# EAGLE design barrieren-a-3 (EAGLE 9.6.2)
AUTHOR: Balazs Racz; DRAWING_TITLE: MEB Schalterwerk Projekt; LICENSE: Licensed by the Solderpad Hardware License V2.0; REVIEWER: n/a; REVISION: A5; YEAR: 2023
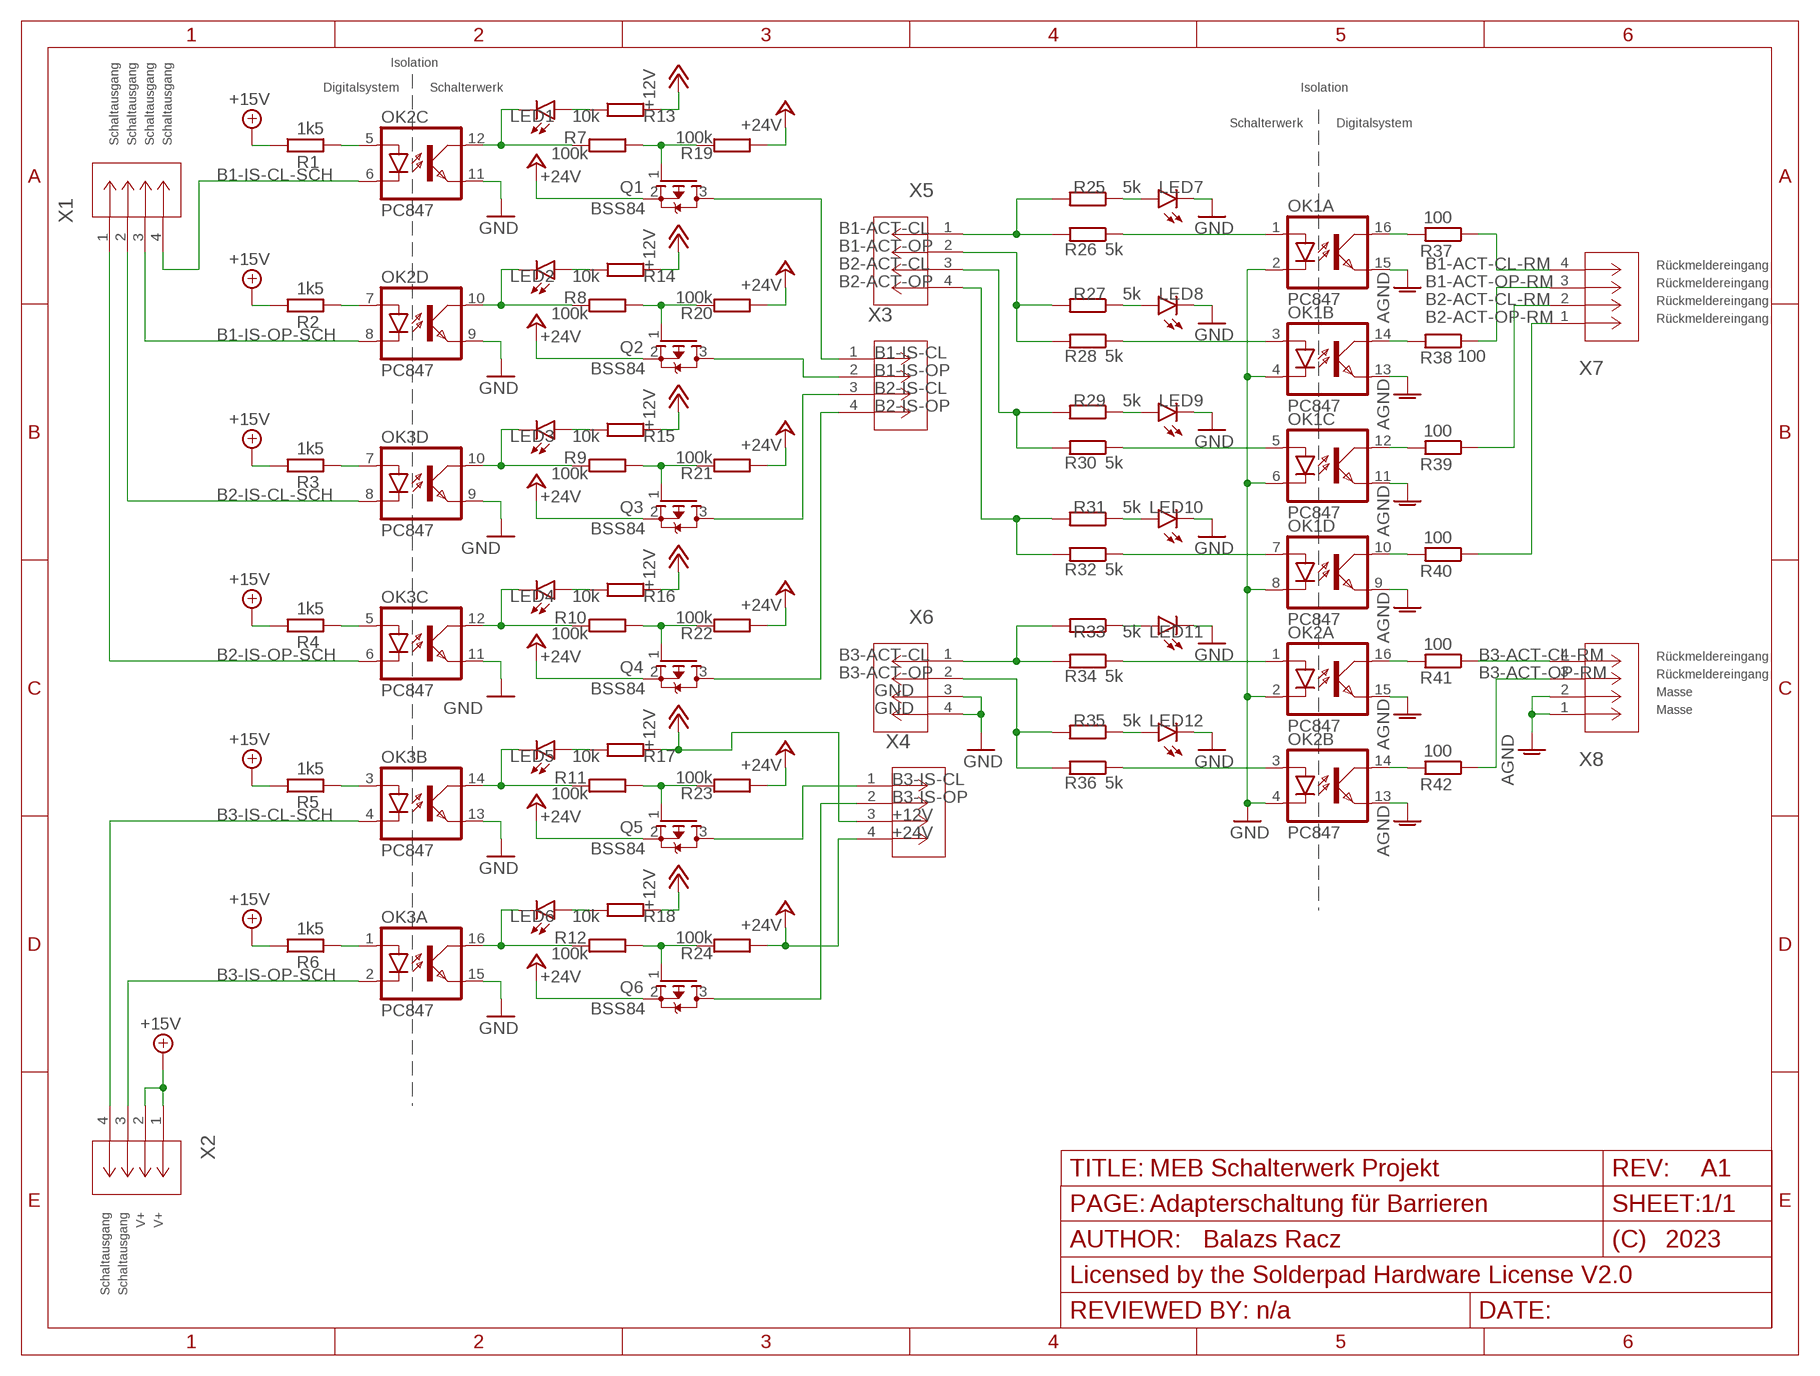
[diagram p0: schematic, sheet 1]
FRAME1 (FRAME_A_L): PAGE: Input ports
FRAME2 (FRAME_A_L): PAGE: Adapterschaltung für Barrieren; REVISION: A1

## Parts
LED1  LEDCHIPLED_0603  [CHIPLED_0603]
LED2  LEDCHIPLED_0603  [CHIPLED_0603]
LED3  LEDCHIPLED_0603  [CHIPLED_0603]
LED4  LEDCHIPLED_0603  [CHIPLED_0603]
LED5  LEDCHIPLED_0603  [CHIPLED_0603]
LED6  LEDCHIPLED_0603  [CHIPLED_0603]
LED7  LEDCHIPLED_0603  [CHIPLED_0603]
LED8  LEDCHIPLED_0603  [CHIPLED_0603]
LED9  LEDCHIPLED_0603  [CHIPLED_0603]
LED10  LEDCHIPLED_0603  [CHIPLED_0603]
LED11  LEDCHIPLED_0603  [CHIPLED_0603]
LED12  LEDCHIPLED_0603  [CHIPLED_0603]
OK1  PC847  [DIL16]
OK2  PC847  [DIL16]
OK3  PC847  [DIL16]
Q1  BSS84  [SOT23-PCH]
Q2  BSS84  [SOT23-PCH]
Q3  BSS84  [SOT23-PCH]
Q4  BSS84  [SOT23-PCH]
Q5  BSS84  [SOT23-PCH]
Q6  BSS84  [SOT23-PCH]
R1  1k5  R-EU_R0805  [R0805]
R2  1k5  R-EU_R0805  [R0805]
R3  1k5  R-EU_R0805  [R0805]
R4  1k5  R-EU_R0805  [R0805]
R5  1k5  R-EU_R0805  [R0805]
R6  1k5  R-EU_R0805  [R0805]
R7  100k  R-EU_R0805  [R0805]
R8  100k  R-EU_R0805  [R0805]
R9  100k  R-EU_R0805  [R0805]
R10  100k  R-EU_R0805  [R0805]
R11  100k  R-EU_R0805  [R0805]
R12  100k  R-EU_R0805  [R0805]
R13  10k  R-EU_R0805  [R0805]
R14  10k  R-EU_R0805  [R0805]
R15  10k  R-EU_R0805  [R0805]
R16  10k  R-EU_R0805  [R0805]
R17  10k  R-EU_R0805  [R0805]
R18  10k  R-EU_R0805  [R0805]
R19  100k  R-EU_R0805  [R0805]
R20  100k  R-EU_R0805  [R0805]
R21  100k  R-EU_R0805  [R0805]
R22  100k  R-EU_R0805  [R0805]
R23  100k  R-EU_R0805  [R0805]
R24  100k  R-EU_R0805  [R0805]
R25  5k  R-EU_R0805  [R0805]
R26  5k  R-EU_R0805  [R0805]
R27  5k  R-EU_R0805  [R0805]
R28  5k  R-EU_R0805  [R0805]
R29  5k  R-EU_R0805  [R0805]
R30  5k  R-EU_R0805  [R0805]
R31  5k  R-EU_R0805  [R0805]
R32  5k  R-EU_R0805  [R0805]
R33  5k  R-EU_R0805  [R0805]
R34  5k  R-EU_R0805  [R0805]
R35  5k  R-EU_R0805  [R0805]
R36  5k  R-EU_R0805  [R0805]
R37  100  R-EU_R0805  [R0805]
R38  100  R-EU_R0805  [R0805]
R39  100  R-EU_R0805  [R0805]
R40  100  R-EU_R0805  [R0805]
R41  100  R-EU_R0805  [R0805]
R42  100  R-EU_R0805  [R0805]
X1  PHNX_4P_350CONN_1984989_PXC  [PHNX_4P_350]
X2  PHNX_4P_350CONN_1984989_PXC  [PHNX_4P_350]
X3  PHNX_4P_350CONN_1984989_PXC  [PHNX_4P_350]
X4  PHNX_4P_350CONN_1984989_PXC  [PHNX_4P_350]
X5  PHNX_4P_350CONN_1984989_PXC  [PHNX_4P_350]
X6  PHNX_4P_350CONN_1984989_PXC  [PHNX_4P_350]
X7  PHNX_4P_350CONN_1984989_PXC  [PHNX_4P_350]
X8  PHNX_4P_350CONN_1984989_PXC  [PHNX_4P_350]

## Nets
+12V: R13.2 R14.2 R15.2 R16.2 R17.2 R18.2 X4.3
+15V: R1.1 R2.1 R3.1 R4.1 R5.1 R6.1 X2.1 X2.2
+24V: Q1.2(S) Q2.2(S) Q3.2(S) Q4.2(S) Q5.2(S) Q6.2(S) R19.2 R20.2 R21.2 R22.2 R23.2 R24.2 X4.4
AGND: OK1.9(D:EMIT) OK1.11(C:EMIT) OK1.13(B:EMIT) OK1.15(A:EMIT) OK2.13(B:EMIT) OK2.15(A:EMIT) X8.1 X8.2
B1-ACT-CL: R25.2 R26.2 X5.1
B1-ACT-CL-RM: R37.1 X7.4
B1-ACT-OP: R27.2 R28.2 X5.2
B1-ACT-OP-RM: R38.1 X7.3
B1-IS-CL: Q1.3(D) X3.1
B1-IS-CL-SCH: OK2.6(C:C) X1.4
B1-IS-OP: Q2.3(D) X3.2
B1-IS-OP-SCH: OK2.8(D:C) X1.3
B2-ACT-CL: R29.2 R30.2 X5.3
B2-ACT-CL-RM: R39.1 X7.2
B2-ACT-OP: R31.2 R32.2 X5.4
B2-ACT-OP-RM: R40.1 X7.1
B2-IS-CL: Q3.3(D) X3.3
B2-IS-CL-SCH: OK3.8(D:C) X1.2
B2-IS-OP: Q4.3(D) X3.4
B2-IS-OP-SCH: OK3.6(C:C) X1.1
B3-ACT-CL: R33.2 R34.2 X6.1
B3-ACT-CL-RM: R41.1 X8.4
B3-ACT-OP: R35.2 R36.2 X6.2
B3-ACT-OP-RM: R42.1 X8.3
B3-IS-CL: Q5.3(D) X4.1
B3-IS-CL-SCH: OK3.4(B:C) X2.4
B3-IS-OP: Q6.3(D) X4.2
B3-IS-OP-SCH: OK3.2(A:C) X2.3
GND: LED7.C LED8.C LED9.C LED10.C LED11.C LED12.C OK1.2(A:C) OK1.4(B:C) OK1.6(C:C) OK1.8(D:C) OK2.2(A:C) OK2.4(B:C) OK2.9(D:EMIT) OK2.11(C:EMIT) OK3.9(D:EMIT) OK3.11(C:EMIT) OK3.13(B:EMIT) OK3.15(A:EMIT) X6.3 X6.4
N$1: Q1.1(G) R7.1 R19.1
N$2: OK2.1(A:A) R34.1
N$3: LED12.A R35.1
N$4: LED11.A R33.1
N$5: OK2.5(C:A) R1.2
N$6: OK1.12(C:COL) R39.2
N$7: OK2.3(B:A) R36.1
N$8: OK2.7(D:A) R2.2
N$9: OK1.10(D:COL) R40.2
N$10: OK1.5(C:A) R30.1
N$11: LED1.A R13.1
N$12: LED2.A R14.1
N$13: LED2.C OK2.10(D:COL) R8.2
N$14: Q2.1(G) R8.1 R20.1
N$15: OK3.7(D:A) R3.2
N$16: OK1.7(D:A) R32.1
N$17: LED9.A R29.1
N$18: LED3.A R15.1
N$19: OK2.16(A:COL) R41.2
N$20: LED3.C OK3.10(D:COL) R9.2
N$21: OK2.14(B:COL) R42.2
N$22: Q3.1(G) R9.1 R21.1
N$23: OK3.5(C:A) R4.2
N$24: LED10.A R31.1
N$29: LED4.A R16.1
N$30: OK1.16(A:COL) R37.2
N$31: LED1.C OK2.12(C:COL) R7.2
N$32: OK1.14(B:COL) R38.2
N$33: OK1.1(A:A) R26.1
N$34: LED4.C OK3.12(C:COL) R10.2
N$35: OK1.3(B:A) R28.1
N$36: LED7.A R25.1
N$37: LED8.A R27.1
N$40: Q4.1(G) R10.1 R22.1
N$41: OK3.3(B:A) R5.2
N$42: LED5.A R17.1
N$43: LED5.C OK3.14(B:COL) R11.2
N$44: Q5.1(G) R11.1 R23.1
N$45: OK3.1(A:A) R6.2
N$46: LED6.A R18.1
N$47: LED6.C OK3.16(A:COL) R12.2
N$48: Q6.1(G) R12.1 R24.1

## Notes on the sheet
- Isolation
- Digitalsystem | Schalterwerk | Isolation
- Schalterwerk | Digitalsystem
- Schaltausgang | Schaltausgang | Schaltausgang | Schaltausgang
- Rückmeldereingang
- Rückmeldereingang
- Rückmeldereingang
- Rückmeldereingang
- Rückmeldereingang
- Rückmeldereingang
- Masse
- Masse
- Schaltausgang | Schaltausgang | V+ | V+

## Library data of the parts
LED1-LED12 = led:LED: LED OSRAM: - CHIPLED LG R971, LG N971, LY N971, LG Q971, LY Q971, LO R971, LY R971 LH N974, LH R974 LS Q976, LO Q976, LY Q976 LO Q996 - Hyper CHIPLED LW Q18S LB Q993, LB Q99A, LB R99A - SideLED LS A670, LO A670, LY A670, LG A670, LP A670 LB A673, LV A673, LT A673, LW A673 LH A674 LY A675 LS A676, LA A676, LO A676, LY A676, LW A676 LS A679, LY A679, LG A679 - Hyper Micro SIDELED® LS Y876, LA Y876, LO Y876, LY Y876 LT Y87S - SmartLED LW L88C, LW L88S LB L89C, LB L89S, LG L890 LS L89K, LO L89K, LY L89K LS L896, LA L896, LO L896, LY L896 - TOPLED LS T670, LO T670, LY T670, LG T670, LP T670 LSG T670, LSP T670, LSY T670, LOP T670, LYG T670 LG T671, LOG T671, LSG T671 LB T673, LV T673, LT T673, LW T673 LH T674 LS T676, LA T676, LO T676, LY T676, LB T676, LH T676, LSB T676, LW T676 LB T67C, LV T67C, LT T67C, LS T67K, LO T67K, LY T67K, LW E67C LS E67B, LA E67B, LO E67B, LY E67B, LB E67C, LV E67C, LT E67C LW T67C LS T679, LY T679, LG T679 LS T770, LO T770, LY T770, LG T770, LP T770 LB T773, LV T773, LT T773, LW T773 LH T774 LS E675, LA E675, LY E675, LS T675 LS T776, LA T776, LO T776, LY T776, LB T776 LHGB T686 LT T68C, LB T68C - Hyper Mini TOPLED® LB M676 - Mini TOPLED Santana® LG M470 LS M47K, LO M47K, LY M47K Source: http://www.osram.convergy.de LUXEON: - LUMILED® LXK2-PW12-R00, LXK2-PW12-S00, LXK2-PW14-U00, LXK2-PW14-V00 LXK2-PM12-R00, LXK2-PM12-S00, LXK2-PM14-U00 LXK2-PE12-Q00, LXK2-PE12-R00, LXK2-PE12-S00, LXK2-PE14-T00, LXK2-PE14-U00 LXK2-PB12-K00, LXK2-PB12-L00, LXK2-PB12-M00, LXK2-PB14-N00, LXK2-PB14-P00, LXK2-PB14-Q00 LXK2-PR12-L00, LXK2-PR12-M00, LXK2-PR14-Q00, LXK2-PR14-R00 LXK2-PD12-Q00, LXK2-PD12-R00, LXK2-PD12-S00 LXK2-PH12-R00, LXK2-PH12-S00 LXK2-PL12-P00, LXK2-PL12-Q00, LXK2-PL12-R00 Source: www.luxeon.com KINGBRIGHT: KA-3528ASYC Source: www.kingbright.com
OK1-OK3 = optocoupler:PC847: SHARP OPTO COUPLER; OC_FARNELL: 9707735; OC_NEWARK: unknown
Q1-Q6 = eagleparts:BSS84: P-CHANNEL MOS FET
R1-R42 = rcl:R-EU_: RESISTOR, European symbol; SPICEPREFIX: R
X1-X8 = eagleparts:PHNX_4P_350: https://www.digikey.com/en/products/detail/phoenix-contact/1984989/2513979 DigiKey 277-6404-ND; COPYRIGHT: Copyright (C) 2023 Ultra Librarian. All rights reserved.; MANUFACTURER_PART_NUMBER: 1984989; MFR_NAME: Phoenix Contact

## Board
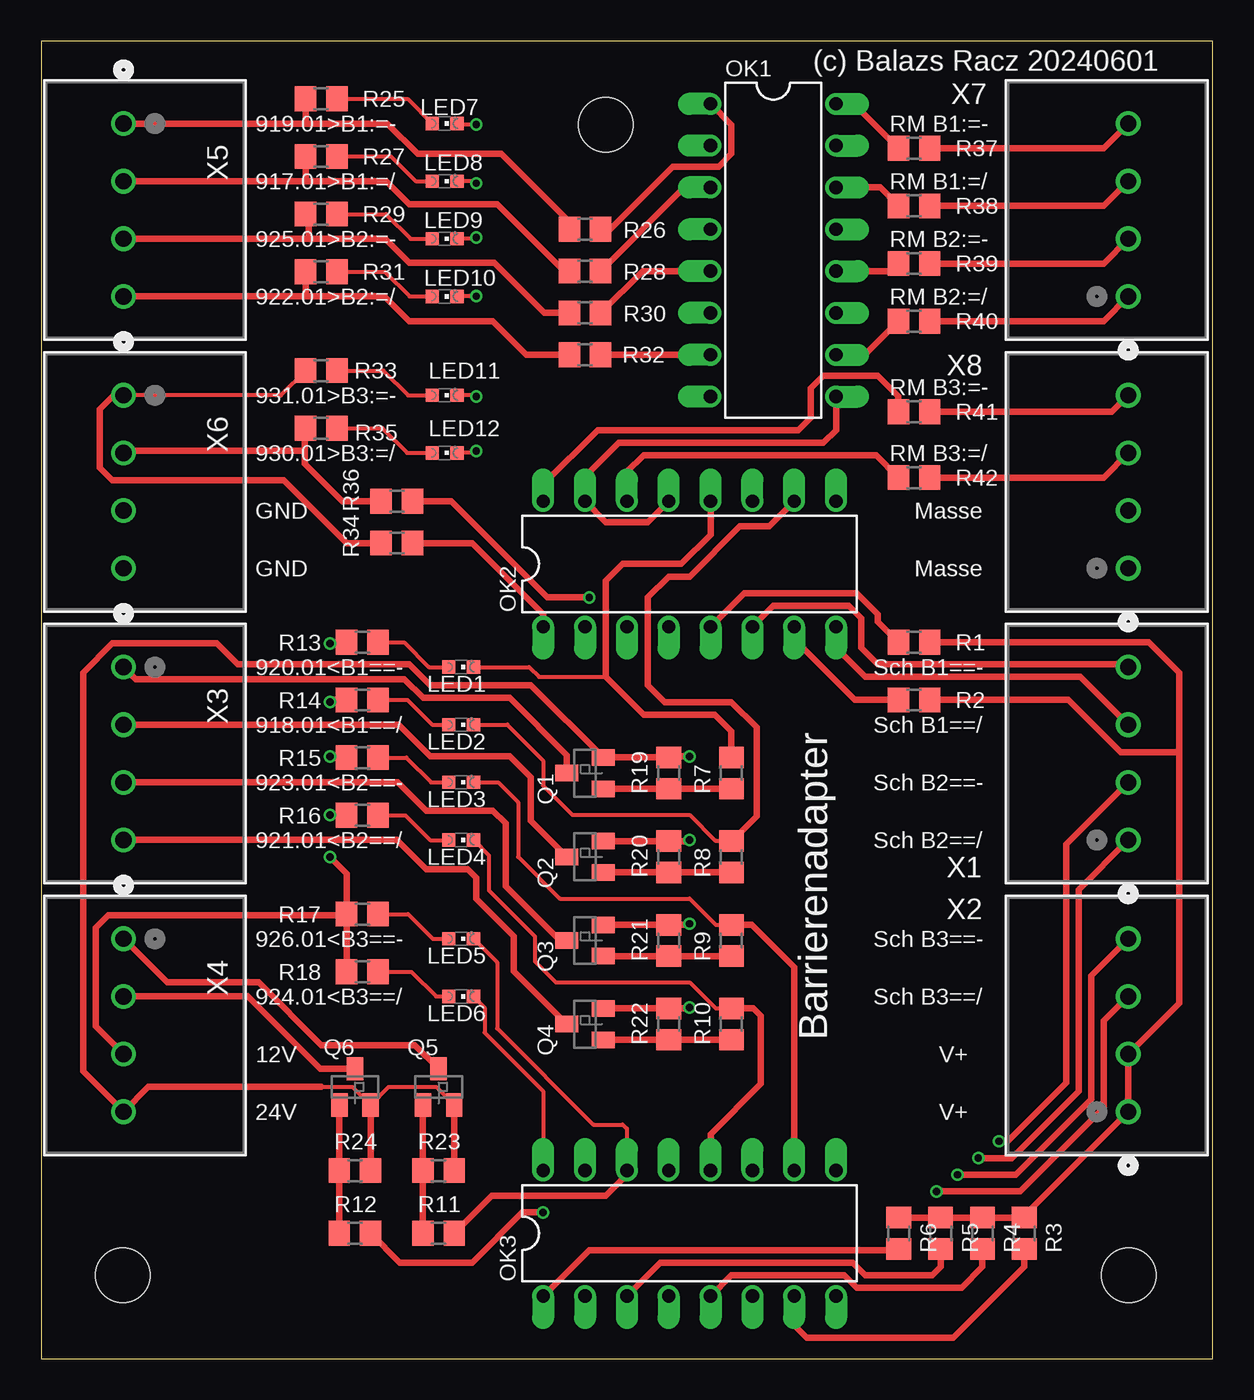
[diagram p1: board, top side]
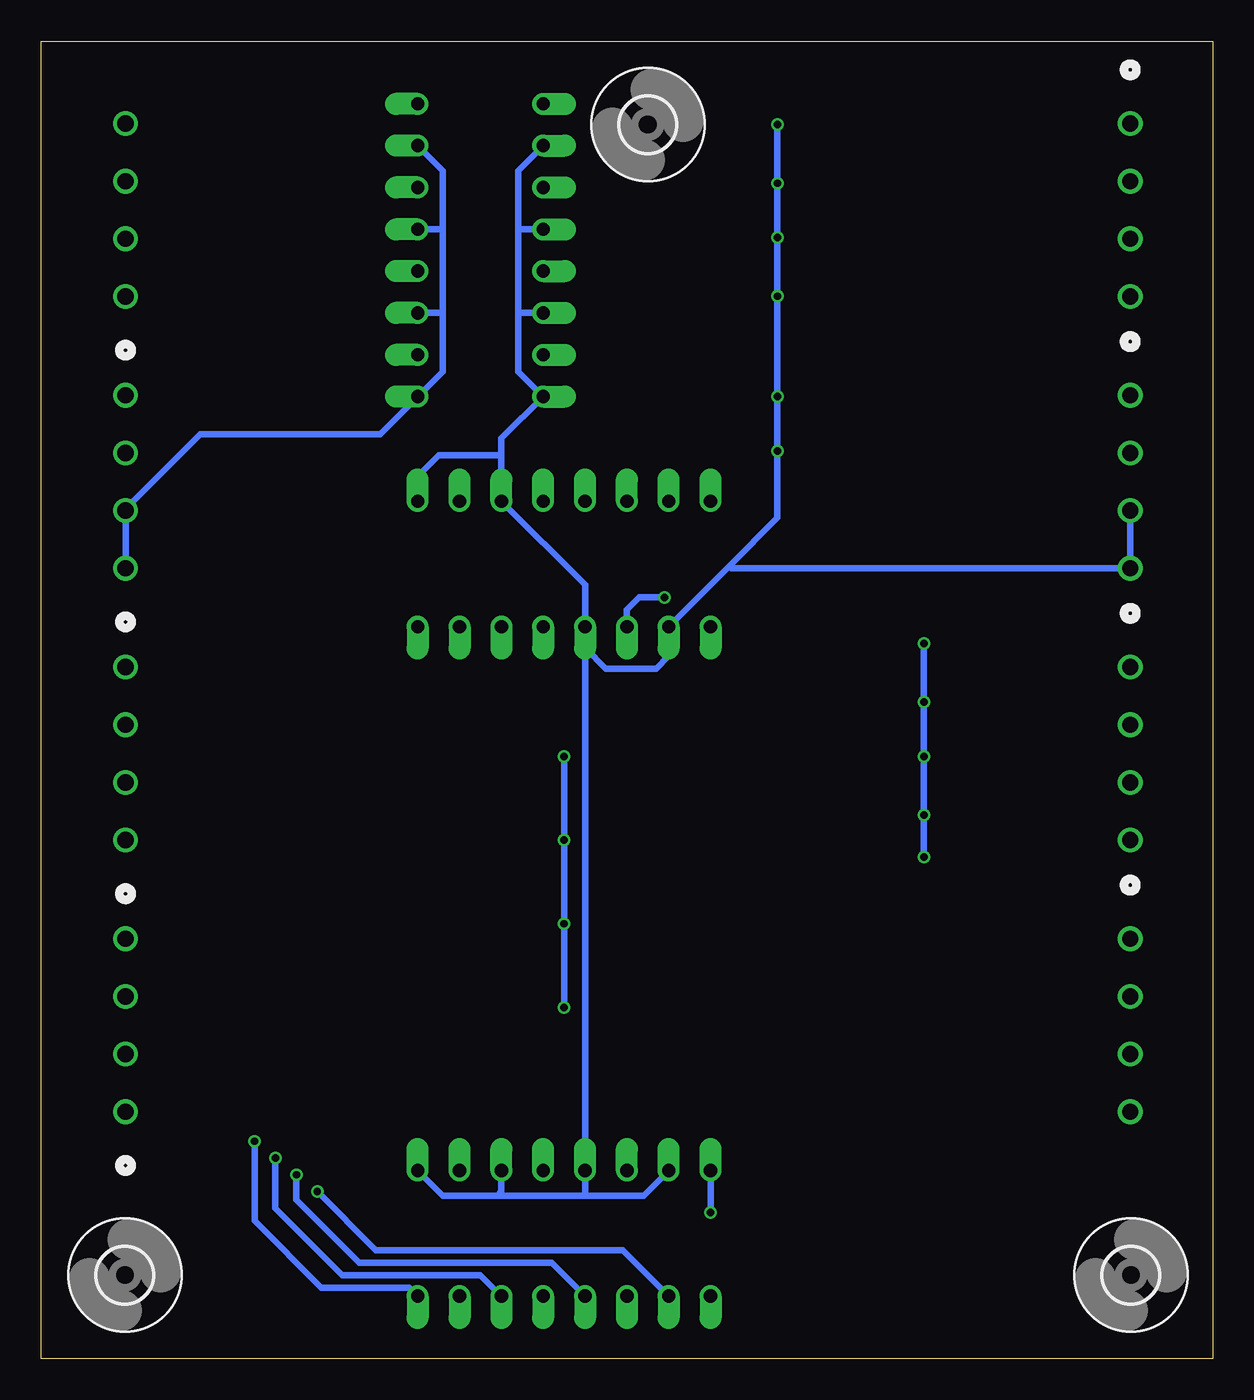
[diagram p2: board, bottom side, seen from below]

Size 71.12 x 80 mm. Coordinates in mm from the lower left corner, seen from the top.
Outline: 0,0 71.12,0 71.12,80 0,80 0,0
Copper layers (1*16): Top 0.035mm / dielectric 1.5mm / Bottom 0.035mm
Design rules "SeeedStudio_2layer_DRU_no_angle_20140221 *": minimum track width 6mil, minimum drill 12mil, track to track 10mil, track to pad 10mil, pad to pad 6mil, via to via 6mil, smd to smd 0mil, copper to edge 10mil, drill to drill 10mil, minimum pad ring 10mil, minimum via ring 6mil, stop-mask expansion 2mil, vias tented up to drill 100mil, thermal gap 10mil

### Footprints (pad centres in the part's own frame; a part is rotated, then mirrored left to right if it is on the bottom)
3,3 = hole 3.3: 0,0
CHIPLED_0603 = smd 0.8 x 0.8: A 0,-0.75; C 0,0.75
DIL16 = drill 0.813 offset: 1 -8.89,-3.81; 2 -6.35,-3.81; 3 -3.81,-3.81; 4 -1.27,-3.81; 5 1.27,-3.81; 6 3.81,-3.81; 7 6.35,-3.81; 8 8.89,-3.81; 9 8.89,3.81; 10 6.35,3.81; 11 3.81,3.81; 12 1.27,3.81; 13 -1.27,3.81; 14 -3.81,3.81; 15 -6.35,3.81; 16 -8.89,3.81
SOT23-PCH = smd 1 x 1.4: 1 -0.95,-1.1; 2 0.95,-1.1; 3 0,1.1
R0805 = smd 1.3 x 1.5: 1 -0.95,0; 2 0.95,0
PHNX_4P_350 = drill 0.991 pad 1.499: 1 0,0; 2 3.5,0; 3 7,0; 4 10.5,0

### Placement (x,y rotation side)
H2  MOUNT-HOLE3.3  [3,3]  4.95,5.08 0 bottom
H3  MOUNT-HOLE3.3  [3,3]  66.04,5.08 0 bottom
H4  MOUNT-HOLE3.3  [3,3]  34.29,74.93 0 bottom
LED1  25.5,42 270 top
LED2  25.5,38.5 270 top
LED3  25.5,35 270 top
LED4  25.5,31.5 270 top
LED5  25.5,25.5 270 top
LED6  25.5,22 270 top
LED7  24.5,75 270 top
LED8  24.5,71.5 270 top
LED9  24.5,68 270 top
LED10  24.5,64.5 270 top
LED11  24.5,58.5 270 top
LED12  24.5,55 270 top
OK1  44.45,67.31 270 top
OK2  39.37,48.26 0 top
OK3  39.37,7.62 0 top
Q1  33.02,35.56 90 top
Q2  33.02,30.48 90 top
Q3  33.02,25.4 90 top
Q4  33.02,20.32 90 top
Q5  24.13,16.51 0 top
Q6  19.05,16.51 0 top
R1  53,43.5 180 top
R2  53,40 180 top
R3  59.69,7.62 270 top
R4  57.15,7.62 270 top
R5  54.61,7.62 270 top
R6  52.07,7.62 270 top
R7  41.91,35.56 90 top
R8  41.91,30.48 90 top
R9  41.91,25.4 90 top
R10  41.91,20.32 90 top
R11  24.13,7.62 0 top
R12  19.05,7.62 0 top
R13  19.5,43.5 180 top
R14  19.5,40 180 top
R15  19.5,36.5 180 top
R16  19.5,33 180 top
R17  19.5,27 180 top
R18  19.5,23.5 180 top
R19  38.1,35.56 90 top
R20  38.1,30.48 90 top
R21  38.1,25.4 90 top
R22  38.1,20.32 90 top
R23  24.13,11.43 0 top
R24  19.05,11.43 0 top
R25  17,76.5 180 top
R26  33.02,68.58 180 top
R27  17,73 180 top
R28  33.02,66.04 180 top
R29  17,69.5 180 top
R30  33.02,63.5 180 top
R31  17,66 180 top
R32  33.02,60.96 180 top
R33  17,60 180 top
R34  21.59,49.53 180 top
R35  17,56.5 180 top
R36  21.59,52.07 180 top
R37  53,73.5 180 top
R38  53,70 180 top
R39  53,66.5 180 top
R40  53,63 180 top
R41  53,57.5 180 top
R42  53,53.5 180 top
X1  66,31.5 90 top
X2  66,15 90 top
X3  5,42 270 top
X4  5,25.5 270 top
X5  5,75 270 top
X6  5,58.5 270 top
X7  66,64.5 90 top
X8  66,48 90 top

### Tracks (layer width: path | path; a pad name or v marks a point on that pad's centre or on a via)
+12V  (via drill 0.45)
  Top 0.406: R13.2 18.48,43.43 v17.53,43.43 | v17.53,39.88 17.65,40 R14.2 | v17.53,36.58 17.6,36.5 R15.2 | v17.53,33.02 18.53,33.02 R16.2 | v17.53,30.48 18.55,29.46 R17.2 | R17.2 R18.2 | X4.3 3.3,20.2 3.3,26.16 4.06,26.92 18.47,26.92 R17.2
  Bottom 0.406: v17.53,43.43 v17.53,39.88 v17.53,36.58 v17.53,33.02 v17.53,30.48
+15V
  Top 0.406: R1.1 67.24,43.5 69.09,41.66 69.09,36.83 | 69.09,36.83 69.09,21.59 X2.2 X2.1 59.69,8.69 R3.1 R4.1 R5.1 R6.1 | R2.1 62.36,40 65.53,36.83 69.09,36.83
+24V  (via drill 0.45)
  Top 0.254: Q5.2 23.98,16.51 21.1,16.51 Q6.2 18.9,16.51 17.02,16.51
  Top 0.406: Q2.2 R20.2 39.3,31.43 v39.37,31.5 | Q4.2 R22.2 39.3,21.27 v39.37,21.34 | Q3.2 R21.2 39.3,26.35 v39.37,26.42 | Q6.2 R24.2 | Q5.2 R23.2 | 17.02,16.51 6.51,16.51 X4.4 2.54,17.46 2.54,41.66 4.32,43.43 10.67,43.43 11.94,42.16 22.35,42.16 23.62,40.89 29.74,40.89 Q1.2 R19.2 38.17,36.58 v39.37,36.58
  Bottom 0.406: v39.37,36.58 v39.37,31.5 v39.37,26.42 v39.37,21.34
AGND
  Top 0.406: OK1.9 48.26,56.39 47.5,55.63 35.05,55.63 33.02,53.59 OK2.15 34.29,50.8 36.83,50.8 OK2.13
  Bottom 0.406: OK1.15 46.74,72.14 46.74,68.58 | 46.74,68.58 46.74,63.5 | 46.74,63.5 46.74,59.94 OK1.9 50.55,56.13 61.47,56.13 66,51.6 X8.2 X8.1 | OK1.13 46.74,68.58 | OK1.11 46.74,63.5
B1-ACT-CL
  Top 0.406: X5.1 16,75 | 16,75 21.01,75 22.86,73.15 27.94,73.15 32.07,69.02 R26.2 | R25.2 16.05,75.05 16,75
B1-ACT-CL-RM
  Top 0.406: X7.4 64.5,73.5 R37.1
B1-ACT-OP
  Top 0.406: X5.2 16,71.5 | 16,71.5 20.96,71.5 22.35,70.1 27.69,70.1 31.75,66.04 R28.2 | R27.2 16.05,71.55 16,71.5
B1-ACT-OP-RM
  Top 0.406: X7.3 64.5,70 R38.1
B1-IS-CL
  Top 0.406: X3.1 5.74,41.26 22.06,41.26 23.19,40.13 28.45,40.13 31.92,36.66 Q1.3
B1-IS-CL-SCH
  Top 0.406: X1.4 65.44,42 65.28,42.16 50.8,42.16 49.78,43.18 49.78,44.96 49.02,45.72 44.45,45.72 OK2.6
B1-IS-OP
  Top 0.406: X3.2 21.7,38.5 23.62,36.58 28.45,36.58 29.72,35.31 29.72,32.68 Q2.3
B1-IS-OP-SCH
  Top 0.406: X1.3 63.1,41.4 50.04,41.4 48.26,43.18 OK2.8
B2-ACT-CL
  Top 0.406: X5.3 16.26,68 | 16.26,68 20.9,68 22.35,66.55 27.5,66.55 30.55,63.5 R30.2 | R29.2 16.26,69.29 16.26,68
B2-ACT-CL-RM
  Top 0.406: X7.2 64.5,66.5 R39.1
B2-ACT-OP
  Top 0.406: X5.4 16,64.5 | 16,64.5 20.84,64.5 22.35,62.99 27.43,62.99 29.46,60.96 R32.2 | R31.2 16.05,64.55 16,64.5
B2-ACT-OP-RM
  Top 0.406: X7.1 64.5,63 R40.1
B2-IS-CL
  Top 0.406: X3.3 21.64,35 23.37,33.27 27.43,33.27 28.19,32.51 28.19,28.7 31.5,25.4 Q3.3
B2-IS-CL-SCH  (via drill 0.45)
  Top 0.406: X1.2 62.23,31.23 62.23,16.76 58.67,13.21 v58.17,13.21
  Bottom 0.406: v58.17,13.21 58.17,8.38 54.1,4.32 48.77,4.32 OK3.8
B2-IS-OP
  Top 0.406: X3.4 21.59,31.5 23.37,29.72 25.91,29.72 26.42,29.21 26.42,27.94 28.7,25.65 28.7,23.54 Q4.3
B2-IS-OP-SCH  (via drill 0.45)
  Top 0.406: X1.1 62.99,28.49 62.99,16.26 58.93,12.19 v56.9,12.19
  Bottom 0.406: v56.9,12.19 56.9,9.14 52.83,5.08 44.45,5.08 OK3.6
B3-ACT-CL
  Top 0.254: R33.2 14.55,58.5 5.33,58.5 X6.1
  Top 0.406: R34.2 18.54,49.53 14.73,53.34 4.32,53.34 3.56,54.1 3.56,57.66 4.4,58.5 5.33,58.5
B3-ACT-CL-RM
  Top 0.406: X8.4 65,57.5 R41.1
B3-ACT-OP
  Top 0.406: R36.2 18.29,52.07 16,54.36 16,55.12 | 16,55.12 16,56.45 R35.2 | X6.2 5.12,55.12 16,55.12
B3-ACT-OP-RM
  Top 0.406: X8.3 64.5,53.5 R42.1
B3-IS-CL
  Top 0.406: X4.1 7.64,22.86 13.21,22.86 17.02,19.05 22.69,19.05 Q5.3
B3-IS-CL-SCH  (via drill 0.45)
  Top 0.406: X2.4 63.75,23.25 63.75,15.75 59.18,11.18 v55.63,11.18
  Bottom 0.406: v55.63,11.18 55.63,9.65 51.82,5.84 40.13,5.84 OK3.4
B3-IS-OP
  Top 0.406: X4.2 12.54,22 16.93,17.61 Q6.3
B3-IS-OP-SCH  (via drill 0.45)
  Top 0.406: X2.3 64.52,20.52 64.52,15.24 59.44,10.16 v54.36,10.16
  Bottom 0.406: v54.36,10.16 50.8,6.6 35.81,6.6 OK3.2
GND  (via drill 0.45)
  Top 0.254: v26.42,74.93 25.32,74.93 LED7.C | v26.42,71.37 26.29,71.5 LED8.C | v26.42,68.07 26.34,68 LED9.C | v26.42,64.52 26.4,64.5 LED10.C | v26.42,58.42 26.34,58.5 LED11.C | v26.42,55.12 26.3,55 LED12.C
  Bottom 0.254: 26.42,71.63 v26.42,71.37 | 26.42,54.86 v26.42,55.12
  Bottom 0.406: OK1.2 42.16,72.14 42.16,68.58 | 42.16,68.58 42.16,63.5 | 42.16,63.5 42.16,59.94 OK1.8 43.18,55.88 43.18,54.86 | OK1.6 42.16,63.5 | OK1.4 42.16,68.58 | 43.18,54.86 OK2.11 38.1,46.99 OK2.4 | OK2.9 48.26,53.59 46.99,54.86 43.18,54.86 | OK2.4 38.1,43.18 36.83,41.91 33.78,41.91 33.02,42.67 OK2.2 29.34,48.13 | OK2.4 OK3.13 38.1,9.91 | OK3.15 34.54,9.91 38.1,9.91 | OK3.9 46.74,9.91 43.43,9.91 | 38.1,9.91 43.43,9.91 | OK3.11 43.18,10.16 43.43,9.91 | 29.34,48.13 26.42,51.05 26.42,54.86 | v26.42,55.12 v26.42,58.42 v26.42,64.52 v26.42,68.07 v26.42,71.37 | v26.42,74.93 26.42,71.63 | X6.3 X6.4 29.2,48 29.34,48.13
N$1
  Top 0.406: Q1.1 R19.1 R7.1
N$2
  Top 0.406: R34.1 26.16,49.53 30.48,45.21 OK2.1
N$3
  Top 0.254: R35.1 20.72,56.5 22.22,55 LED12.A
N$4
  Top 0.254: R33.1 20.77,60 22.27,58.5 LED11.A
N$5
  Top 0.406: R1.2 50.8,44.75 50.8,45.21 49.53,46.48 42.67,46.48 OK2.5
N$6
  Top 0.406: R39.2 51.59,66.04 OK1.12
N$7  (via drill 0.45)
  Top 0.406: R36.1 24.89,52.07 30.73,46.23 v33.27,46.23
  Bottom 0.406: v33.27,46.23 34.8,46.23 35.56,45.47 OK2.3
N$8
  Top 0.406: R2.2 49.41,40 45.72,43.69 OK2.7
N$9
  Top 0.406: R40.2 50.01,60.96 OK1.10
N$10
  Top 0.406: R30.1 36.51,66.04 OK1.5
N$11
  Top 0.254: R13.1 22.03,43.5 23.53,42 LED1.A
N$12
  Top 0.254: R14.1 22.23,40 23.73,38.5 LED2.A
N$13
  Top 0.254: LED2.C 28.3,38.5 30.48,36.32 30.48,34.8 32.26,33.02 39.37,33.02 40.93,31.46 41.94,31.46
  Top 0.406: OK2.10 44.2,50.55 42.42,50.55 39.37,47.5 38.1,47.5 36.83,46.23 36.83,40.89 37.85,39.88 41.91,39.88 43.43,38.35 43.43,32.95 41.94,31.46 R8.2
N$14
  Top 0.406: Q2.1 R20.1 R8.1
N$15
  Top 0.406: R3.2 59.69,5.59 55.37,1.27 46.48,1.27 45.72,2.03 OK3.7
N$16
  Top 0.406: R32.1 OK1.7
N$17
  Top 0.254: R29.1 20.92,69.5 22.42,68 LED9.A
N$18
  Top 0.254: R15.1 22.17,36.5 23.67,35 LED3.A
N$19
  Top 0.406: R41.2 52.05,58.44 50.8,59.69 47.5,59.69 46.74,58.93 46.74,57.15 45.97,56.39 33.78,56.39 30.48,53.09 OK2.16
N$20
  Top 0.254: LED3.C 27.74,35 28.96,33.78 28.96,30.48 31.5,27.94 39.37,27.94 40.96,26.35 R9.2
  Top 0.406: OK3.10 45.72,23.78 43.15,26.35 R9.2
N$21
  Top 0.406: R42.2 50.69,54.86 36.58,54.86 35.56,53.85 OK2.14
N$22
  Top 0.406: Q3.1 R21.1 R9.1
N$23
  Top 0.406: R4.2 57.15,5.59 55.88,4.32 49.53,4.32 48.77,5.08 41.91,5.08 OK3.5
N$24
  Top 0.254: R31.1 20.87,66 22.37,64.5 LED10.A
N$29
  Top 0.254: R16.1 22.12,33 23.62,31.5 LED4.A
N$30
  Top 0.406: R37.2 49.35,76.2 OK1.16
N$31
  Top 0.254: LED1.C 29.63,42 30.23,41.4 34.29,41.4
  Top 0.406: OK2.12 40.64,50.04 38.86,48.26 35.31,48.26 34.29,47.24 34.29,41.4 36.58,39.12 40.89,39.12 41.91,38.1 R7.2
N$32
  Top 0.406: R38.2 50.93,71.12 OK1.14
N$33
  Top 0.406: OK1.1 41.91,74.93 41.91,73.15 41.15,72.39 38.35,72.39 34.54,68.58 R26.1
N$34
  Top 0.254: LED4.C 27.18,30.57 27.18,28.45 29.97,25.65 29.97,24.13 31.24,22.86 39.37,22.86 40.96,21.27 R10.2
  Top 0.406: OK3.12 40.64,13.64 43.69,16.69 43.69,20.83 43.25,21.27 R10.2
N$35
  Top 0.406: R28.1 39.05,71.12 OK1.3
N$36
  Top 0.254: R25.1 22.25,76.5 LED7.A
N$37
  Top 0.254: R27.1 21.23,73 22.73,71.5 LED8.A
N$40
  Top 0.406: Q4.1 R22.1 R10.1
N$41
  Top 0.406: R5.2 54.61,5.59 54.1,5.08 50.04,5.08 49.28,5.84 37.59,5.84 OK3.3
N$42
  Top 0.254: R17.1 22.28,27 23.78,25.5 LED5.A
N$43
  Top 0.254: LED5.C 27.69,24.06 27.69,20.07 33.53,14.22 35.31,14.22 35.56,13.97 OK3.14
  Top 0.406: R11.2 27.37,9.91 34.29,9.91 35.56,11.18 OK3.14
N$44
  Top 0.406: Q5.1 R23.1 R11.1
N$45
  Top 0.406: R6.2 52,6.6 33.27,6.6 OK3.1
N$46
  Top 0.254: R18.1 22.47,23.5 23.97,22 LED6.A
N$47  (via drill 0.45)
  Top 0.254: LED6.C 26.92,21.33 26.92,19.81 30.48,16.26 OK3.16
  Top 0.406: R12.2 21.78,5.84 26.16,5.84 29.21,8.89 v30.48,8.89
  Bottom 0.406: v30.48,8.89 OK3.16
N$48
  Top 0.406: Q6.1 R24.1 R12.1

### Text on the board
tNames: (c) Balazs Racz 20240601 | 919.01>B1:=- | RM B1:=- | 917.01>B1:=/ | RM B1:=/ | 925.01>B2:=- | RM B2:=- | 922.01>B2:=/ | RM B2:=/ | RM B3:=- | 931.01>B3:=- | 930.01>B3:=/ | RM B3:=/ | GND | Masse | GND | Masse | 920.01<B1==- | Sch B1==- | 918.01<B1==/ | Sch B1==/ | 923.01<B2==- | Sch B2==- | 921.01<B2==/ | Sch B2==/ | 926.01<B3==- | Sch B3==- | 924.01<B3==/ | Sch B3==/ | Barrierenadapter | 12V | V+ | 24V | V+